# Altium schematic sheet Power.SchDoc
size A4; SheetNumber: 2; SheetTotal: 5
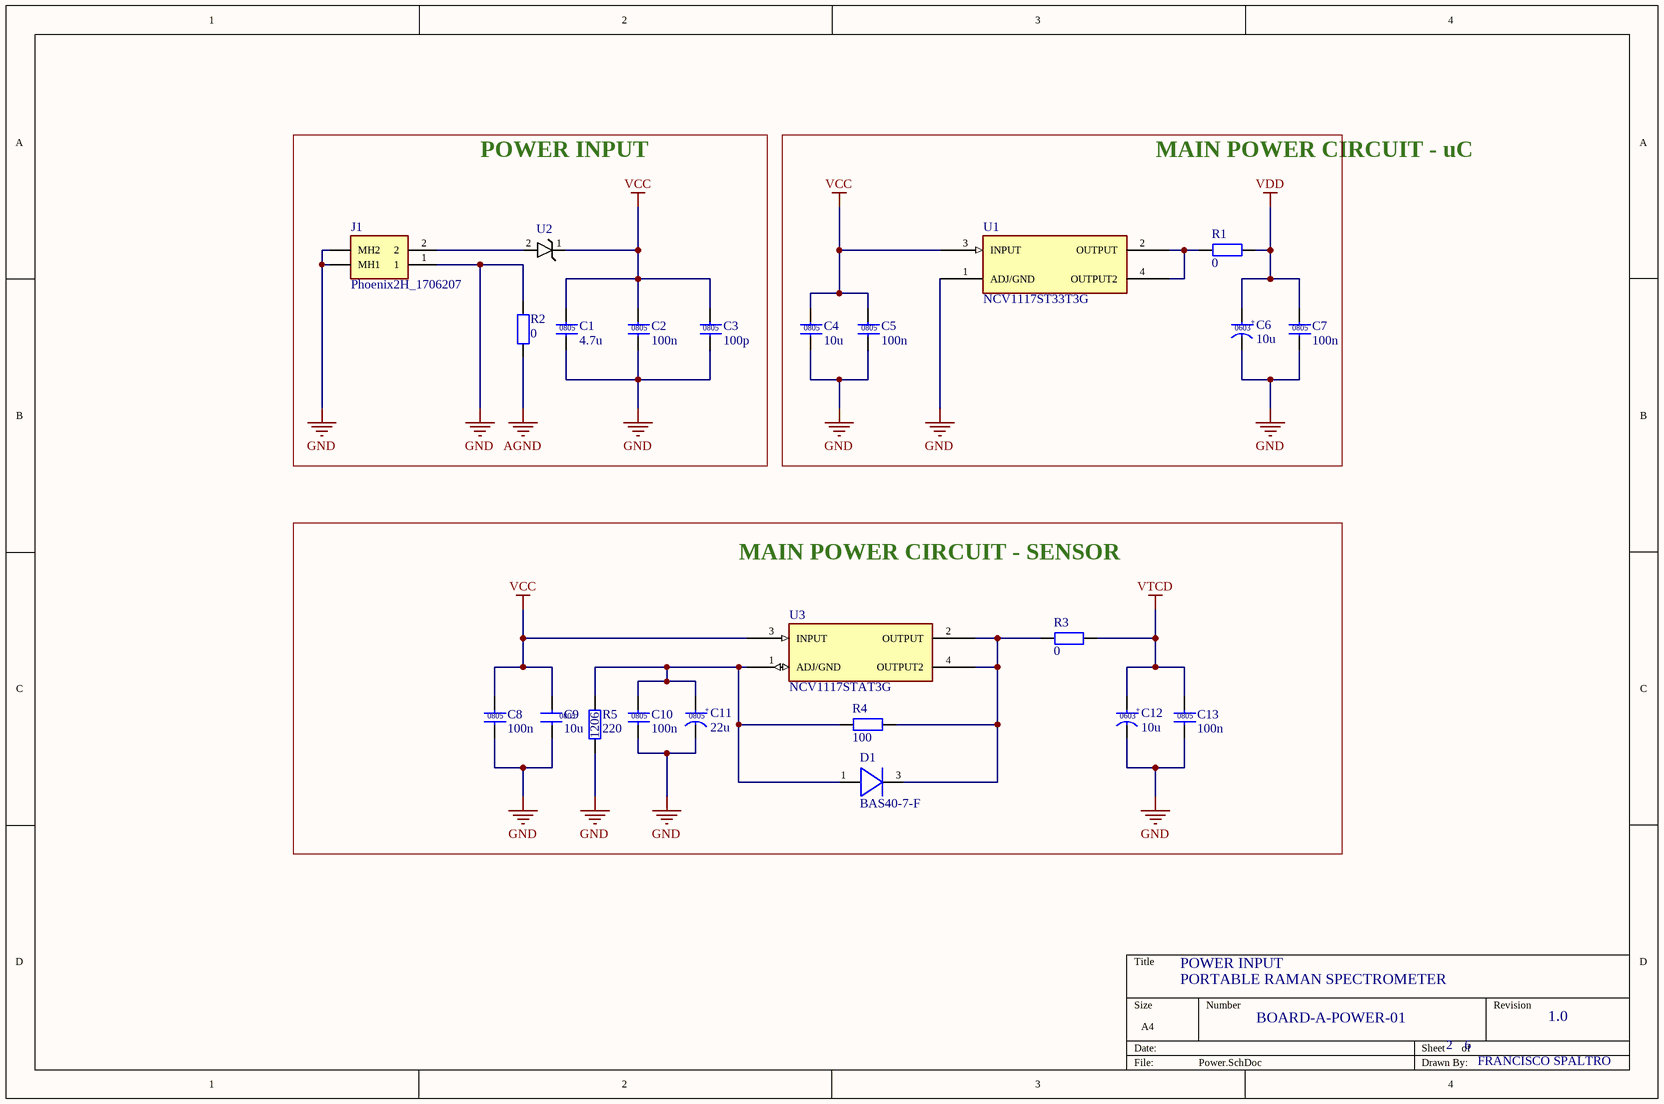
[diagram p0: Power.SchDoc]

## Parts
C1  4.7u  [RES_0805]
C2  100n  [RES_0805]
C3  100p  [RES_0805]
C4  10u  [RES_0805]
C5  100n  [RES_0805]
C6  10u  [CAP_0603_POL-M]
C7  100n  [RES_0805]
C8  100n  [RES_0805]
C9  10u  [RES_0805]
C10  100n  [RES_0805]
C11  22u  [CAP_0805_POL]
C12  10u  [CAP_0603_POL-M]
C13  100n  [RES_0805]
D1  BAS40-7-F  [SOT-23_DIO-M]
J1  Phoenix2H_1706207  [PHOENIX_1706207]
R1  0  [RES_0805]
R2  0  [RES_0805]
R3  0  [RES_0805]
R4  100  [RES_0805]
R5  220  [RES_1206]
U1  NCV1117ST33T3G  [SOT230P700X180-4N]
U2  MBRA340T3G  [SMA_ONS]  (value not drawn)
U3  NCV1117STAT3G  [SOT223-3_ONS-M]

## Blocks framed on the sheet
POWER INPUT: C1-C3 J1 R2 U2
MAIN POWER CIRCUIT - uC: C4-C7 R1 U1
MAIN POWER CIRCUIT - SENSOR: C8-C13 D1 R3-R5 U3

## Nets
AGND: R2.1
GND: C1.2 C2.2 C3.2 C4.2 C5.2 C6.2 C7.2 C8.2 C9.2 C10.2 C11.2 C12.2 C13.2 J1.1 J1.MH1 J1.MH2 R2.2 R5.1 U1.1(ADJ/GND)
VCC: C1.1 C2.1 C3.1 C4.1 C5.1 C8.1 C9.1 U1.3(INPUT) U2.1(CATHODE) U3.3(INPUT)
VDD: C6.1 C7.1 R1.2
VTCD: C12.1 C13.1 R3.2
NetC10_1: C10.1 C11.1 D1.1(A) R4.2 R5.2 U3.1(ADJ/GND)
NetD1_3: D1.3(C) R3.1 R4.1 U3.2(OUTPUT) U3.4(OUTPUT2)
NetJ1_2: J1.2 U2.2(ANODE)
NetR1_1: R1.1 U1.2(OUTPUT) U1.4(OUTPUT2)

## Notes on the sheet
- POWER INPUT
- PORTABLE RAMAN SPECTROMETER
- BOARD-A-POWER-01
- 2
- 6
- 1.0
- FRANCISCO SPALTRO
- (in symbol CAP_0603_POL) +; 0603
- (in symbol CAP_0805) 0805
- (in symbol CAP_0805_POL) +; 0805
- (in symbol RES_1206) 1206

## Library data of the parts
C1 = CAP_0805: Samsung CL21B475KOFNNNE
C2 C5 C7 C8 C10 C13 = CAP_0805: Kemet C0805C104K3RAC7800
C3 = CAP_0805: Kemet C0805C101J5GACTU
C4 C9 = CAP_0805: Samsung CL21B106KOQNNNE
C6 C12 = CAP_0603_POL: KYOCERA AVX F381A106MMA
C11 = CAP_0805_POL: Kyocera AVX F951A226MPAAQ2
D1 = DIODE-BAS40-7-F: Description; Manufacturer_Name: Diodes Inc; Type: Diodes - Rectifiers, Single; Copyright: Copyright (C) 2025 Ultra Librarian. All rights reserved.; Manufacturer_Part_Number: BAS40-7-F; RefDes: RefDes
R1-R4 = RES_0805: Generic Capacitor
R5 = RES_1206: Generic 1206 Resistor
U1 = REG3_3-NCV1117ST33T3G: Linear Voltage Regulator IC Positive Fixed 1 Output 1A SOT-223; MF: ON Semiconductor; SnapEDA_Link: https://www.snapeda.com/parts/NCV1117ST33T3G/Onsemi/view-part/?ref=snap; Package: SOT-223-4 ON Semiconductor; Value: *; MP: NCV1117ST33T3G; Check_prices: https://www.snapeda.com/parts/NCV1117ST33T3G/Onsemi/view-part/?ref=eda
U2 = MBRA340T3G: Description; Manufacturer_Name: onsemi; Copyright: Copyright (C) 2025 Ultra Librarian. All rights reserved.; Manufacturer_Part_Number: MBRA340T3G; RefDes: RefDes; Type: Type
U3 = NCV1117STAT3G: Description; Manufacturer_Name: onsemi; Copyright: Copyright (C) 2025 Ultra Librarian. All rights reserved.; Manufacturer_Part_Number: NCV1117STAT3G; RefDes: RefDes; Type: Type
J1 = Phoenix2H_1706207: Package: None; Price: None; Value: *; MP: 1706207; Availability: Unavailable